# Altium project Zlab_Khodaparast.PrjPcb
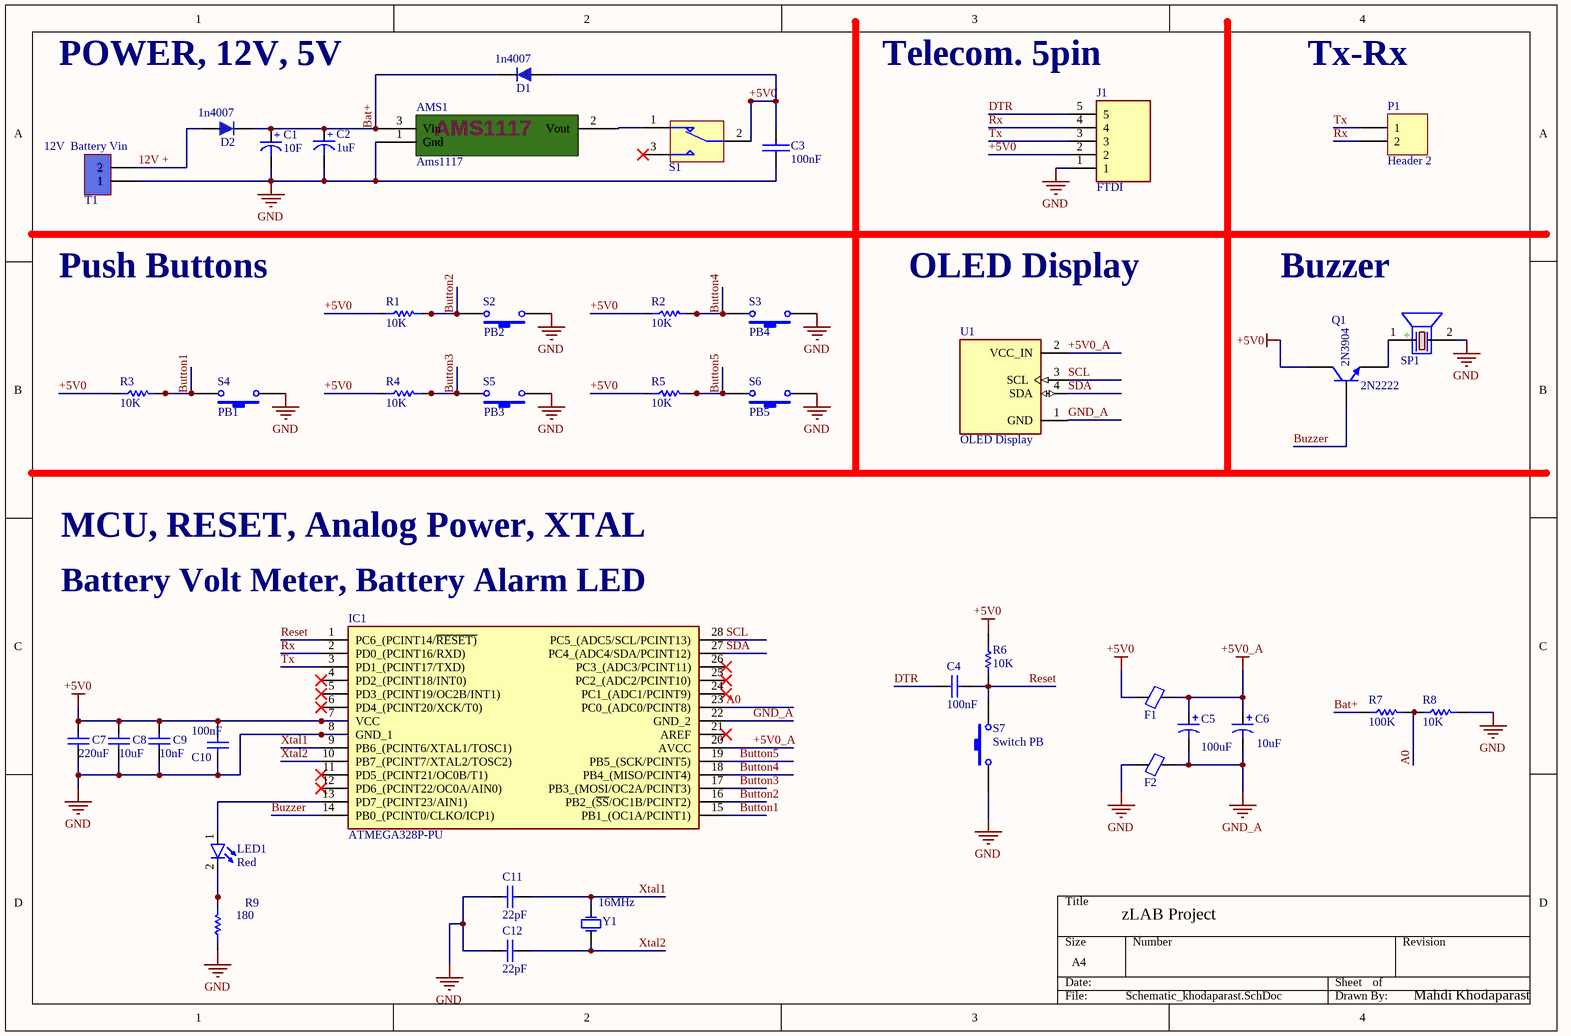
[diagram p0: Schematic_khodaparast.SchDoc]
1 sheet, 42 parts. Net scope: global (net labels, ports and power ports of the same name join across sheets).
Board file: PCB_khodaparast.PcbDoc

## Sheet Schematic_khodaparast.SchDoc
size A4; SheetNumber: 1; SheetTotal: 1

### Parts
AMS1  Ams1117  [Ams1117-3v3]
C1  10F  [Cap1206_(3216X18L)Size A]
C2  1uF  [Cap1206_(3216X18L)Size A]
C3  100nF  [CAP805]
C4  100nF  [CAP805]
C5  value 100uF  [Cap1206_(3216X18L)Size A]  (hidden comment: Cap Pol1)
C6  value 10uF  [Cap1206_(3216X18L)Size A]  (hidden comment: Cap Pol1)
C7  value 220uF  [CAP805]  (hidden comment: Cap)
C8  value 10uF  [CAP805]  (hidden comment: Cap)
C9  value 10nF  [CAP805]  (hidden comment: Cap)
C10  100nF  [CAP805]
C11  22pF  [CAP805]
C12  22pF  [CAP805]
D1  1n4007  [DIOM4629X24N]
D2  1n4007  [DIOM4629X24N]
F1  Ferrite Bead SMD  [FB0805]  (value not drawn)
F2  Ferrite Bead SMD  [FB0805]  (value not drawn)
IC1  ATMEGA328P-PU  [27_DIP_7.62mm]
J1  FTDI  [HDR1X5]
LED1  Red  [LED-RED]
P1  Header 2  [HDR1X2]
Q1  2N2222  [2N3904]
R1  10K  [RES 0805 (2012X06L)]
R2  10K  [RES 0805 (2012X06L)]
R3  10K  [RES 0805 (2012X06L)]
R4  10K  [RES 0805 (2012X06L)]
R5  10K  [RES 0805 (2012X06L)]
R6  value 10K  [RES 0805 (2012X06L)]  (hidden comment: Res1)
R7  100K  [RES 0805 (2012X06L)]
R8  10K  [RES 0805 (2012X06L)]
R9  180  [RES 0805 (2012X06L)]
S1  Switch SPDT_Subminiator  [SPDT Subminiator]  (value not drawn)
S2  PB2  [SW-PB]
S3  PB4  [SW-PB]
S4  PB1  [SW-PB]
S5  PB3  [SW-PB]
S6  PB5  [SW-PB]
S7  Switch PB  [SW-PB]
SP1  (no value)  [BUZZER 7.62mm DC]
T1  12V  Battery Vin  [KF301 2PIN]
U1  OLED Display  [MODULE_DM-OLED096-636]
Y1  16MHz  [XTAL 16MHZ]

### Nets
+5V0: C3.1(+) C7.2 C8.2 C9.2 C10.1 D1.1 F1.1 IC1.7(VCC) J1.2 Q1.3(C) R1.1 R2.1 R3.1 R4.1 R5.1 R6.2 S1.2
+5V0_A: C5.1 C6.1 F1.2 IC1.20(AVCC) U1.2(VCC_IN)
GND: AMS1.1(Gnd) C1.2(-) C2.2(-) C3.2(-) C7.1 C8.1 C9.1 C10.2 C11.2 C12.2 F2.1 IC1.8(GND_1) J1.1 R8.2 R9.1 S2.1 S3.1 S4.1 S5.1 S6.1 S7.1 SP1.2(-) T1.1
GND_A: C5.2 C6.2 F2.2 IC1.22(GND_2) U1.1(GND)
12V +: D2.1 T1.2
A0: IC1.23(PC0_(ADC0/PCINT8)) R7.2 R8.1
Bat+: AMS1.3(Vin) C1.1(+) C2.1(+) D1.2 D2.2 R7.1
Button1: IC1.15(PB1_(OC1A/PCINT1)) R3.2 S4.2
Button2: IC1.16(PB2_(~{SS}/OC1B/PCINT2)) R1.2 S2.2
Button3: IC1.17(PB3_(MOSI/OC2A/PCINT3)) R4.2 S5.2
Button4: IC1.18(PB4_(MISO/PCINT4)) R2.2 S3.2
Button5: IC1.19(PB5_(SCK/PCINT5)) R5.2 S6.2
Buzzer: IC1.14(PB0_(PCINT0/CLKO/ICP1)) Q1.2(B)
DTR: C4.2 J1.5
Reset: C4.1 IC1.1(PC6_(PCINT14/~{RESET)}) R6.1 S7.2
Rx: IC1.2(PD0_(PCINT16/RXD)) J1.4 P1.2
SCL: IC1.28(PC5_(ADC5/SCL/PCINT13)) U1.3(SCL)
SDA: IC1.27(PC4_(ADC4/SDA/PCINT12)) U1.4(SDA)
Tx: IC1.3(PD1_(PCINT17/TXD)) J1.3 P1.1
Xtal1: C11.1 IC1.9(PB6_(PCINT6/XTAL1/TOSC1)) Y1.2(OSC2)
Xtal2: C12.1 IC1.10(PB7_(PCINT7/XTAL2/TOSC2)) Y1.1(OSC1)
NetAMS1_2: AMS1.2(Vout) S1.1
NetIC1_13: IC1.13(PD7_(PCINT23/AIN1)) LED1.1(A)
NetLED1_2: LED1.2(K) R9.2
NetQ1_1: Q1.1(E) SP1.1(+)

Not connected (* = marked no-connect by the designer): IC1 4(PD2_(PCINT18/INT0))* 5(PD3_(PCINT19/OC2B/INT1))* 6(PD4_(PCINT20/XCK/T0))* 11(PD5_(PCINT21/OC0B/T1))* 12(PD6_(PCINT22/OC0A/AIN0))* 21(AREF)* 24(PC1_(ADC1/PCINT9))* 25(PC2_(ADC2/PCINT10))* 26(PC3_(ADC3/PCINT11))*; S1 3*

### Notes on the sheet
- POWER, 12V, 5V
- (near J1) Telecom. 5pin
- (near P1) Tx-Rx
- Push Buttons
- OLED Display
- Buzzer
- MCU, RESET, Analog Power, XTAL
- (near IC1) Battery Volt Meter, Battery Alarm LED
- zLAB Project
- Mahdi Khodaparast
- (in symbol Ams1117) AMS1117

### Library data of the parts
C1 C2 = Cap-Polar: Polar Capacitor; Designer: Saeid Jorablo; Organazation: ControTec; Voltage: 16V; Adding Date: 1387/12/20
  C1: Value: 10F
  C2: Value: 1uF
C3 = Cap-Bipolar: Bipolar Capacitor; Voltage: 100V; Designer: Saeid Jorablo; Organazation: ControTec; Adding Date: 1387/12/20; Value: 100nF
C4 C10-C12 = CAP SMD 0805: CAP 0805; Designer: Abbas Basereh; Desc.: CAP SMD 0805; Data: 16-12-2016
C5 C6 = Cap Pol1: Polarized Capacitor (Radial); Published: 8-Jun-2000; LatestRevisionDate: 17-Jul-2002; LatestRevisionNote: Re-released for DXP Platform.; PackageReference: RB7.6-15; Publisher: Altium Limited; PackageDescription: Polarized Capacitor (Radial); 2 Leads
C7-C9 = Cap: Capacitor; Published: 8-Jun-2000; LatestRevisionDate: 17-Jul-2002; LatestRevisionNote: Re-released for DXP Platform.; PackageReference: RAD-0.3; Publisher: Altium Limited; PackageDescription: Radial Cap, Thru-Hole; 2 Leads; 0.3 in Pin Spacing
D1 D2 = 1n4007 SMD M7: Standard Rectifiers; Part. No: M7; Manufacturer: DC COMPONENTS; Designer: Abbas Basereh; Link: http://www.tme.eu/en/details/m7/smd-universal-diodes/dc-components/; Link: https://www.aliexpress.com/item/Smd-tube-1n4007-m7-SMA/1213719741.html?spm=2114.01010208.3.1.ZyZ7bC&ws_ab_test=searchweb0_0,searchweb201602_4_10065_10068_10084_10083_10080_10082_10081_10060_10061_10062_10056_10055_10054_10059_10099_10078_10079_427_10073_10103_10102_10096_10052_10050_10051,searchweb201603_4&btsid=db2be5ca-e560-400a-b91c-484ab5ee228b; Data: 16-12-2016
F1 F2 = Ferrite Bead SMD Package: Designer: Ali Hafizi
IC1 = ATMEGA328P-PU: Integrated Circuit; Manufacturer_Name: Microchip; Datasheet Link: http://ww1.microchip.com/downloads/en/DeviceDoc/Atmel-42735-8-bit-AVR-Microcontroller-ATmega328-328P_Datasheet.pdf; Height: 4.572mm; Manufacturer_Part_Number: ATMEGA328P-PU; Arrow Part Number: ATMEGA328P-PU; Arrow Price/Stock: https://www.arrow.com/en/products/atmega328p-pu/microchip-technology; Mouser Part Number: 556-ATMEGA328P-PU; Mouser Price/Stock: https://www.mouser.co.uk/ProductDetail/Microchip-Technology-Atmel/ATMEGA328P-PU?qs=K8BHR703ZXguOQv3sKbWcg%3D%3D
J1 = 171813-0005: Connector; Manufacturer_Name: Molex; Datasheet Link: https://www.molex.com/pdm_docs/sd/1718130003_sd.pdf; Manufacturer_Part_Number: 171813-0005; Mouser Part Number: 538-171813-0005; Mouser Price/Stock: https://www.mouser.co.uk/ProductDetail/Molex/171813-0005?qs=s7UCm7gO1bb8KcxY%2Fby%2FYA%3D%3D
LED1 = LED: Designer: Saeid Jorablo; Organazation: ControTec; Adding Date: 1387/12/22; Color: Red; Size: SMD 1206
P1 = Header 2: Header, 2-Pin; LatestRevisionDate: 17-Jul-2002; LatestRevisionNote: Re-released for DXP Platform.; Publisher: Altium Limited
Q1 = 2N3904: NPN Transistor
R1-R5 R7-R9 = Resistor: Tolerance: 5%; Power: 1/8 W
  R1-R5 R8: Value: 10K
  R7: Value: 100K
  R9: Value: 180
R6 = Res1: Resistor; Published: 8-Jun-2000; LatestRevisionDate: 17-Jul-2002; LatestRevisionNote: Re-released for DXP Platform.; PackageReference: AXIAL-0.3; Publisher: Altium Limited; PackageDescription: Axial Device, Thru-Hole; 2 Leads; 0.3 in Pin Spacing
S1 = Switch SPDT_Subminiator: Subminiator SPDT Switch; Company: E.P.I.L; Design date: 2011/11/02
S2-S7 = Switch PB: Push Button Switch
SP1 = PIEZO BUZZER: PIEZO BUZZER ACTIVE; Designer: Abbas Basereh; Comment_1: SPEAKER AND BEEP; Design Date: 1395/11/14; ComponentLink2Description: Reference; PackageDescription: THD; Publisher: Abbas Basereh; Mounting Technology: THD; Pin Count: 2; Status: Unreleased
T1 = KF301-2Pin_Terminal: Terminal 2 Pin 250VAC 16A; Part. No: KF301 2P; Designer: Abbas Basereh; Link: https://www.aliexpress.com/item/
U1 = DM-OLED096-636: 0.96â€ 128 X 64 MONOCHROME GRAPHIC OLED DISPLAY MODULE - I2C; SnapEDA_Link: https://www.snapeda.com/parts/DM-OLED096-636/Display+Module/view-part/?ref=snap; Package: Package; Value: *; MF: Display Module; MP: DM-OLED096-636; Check_prices: https://www.snapeda.com/parts/DM-OLED096-636/Display+Module/view-part/?ref=eda
Y1 = XTAL: XTAL Crystal; Designer: ABBAS BASEREH; Value: 12 MHz; Design Date: 2017-1-3; ComponentLink1Description: Datasheet; ComponentLink2Description: Reference; Mounting Technology: Surface Mount\Through-Hole; Status: Unreleased